# EAGLE design puck_pcb (EAGLE 7.2.0)
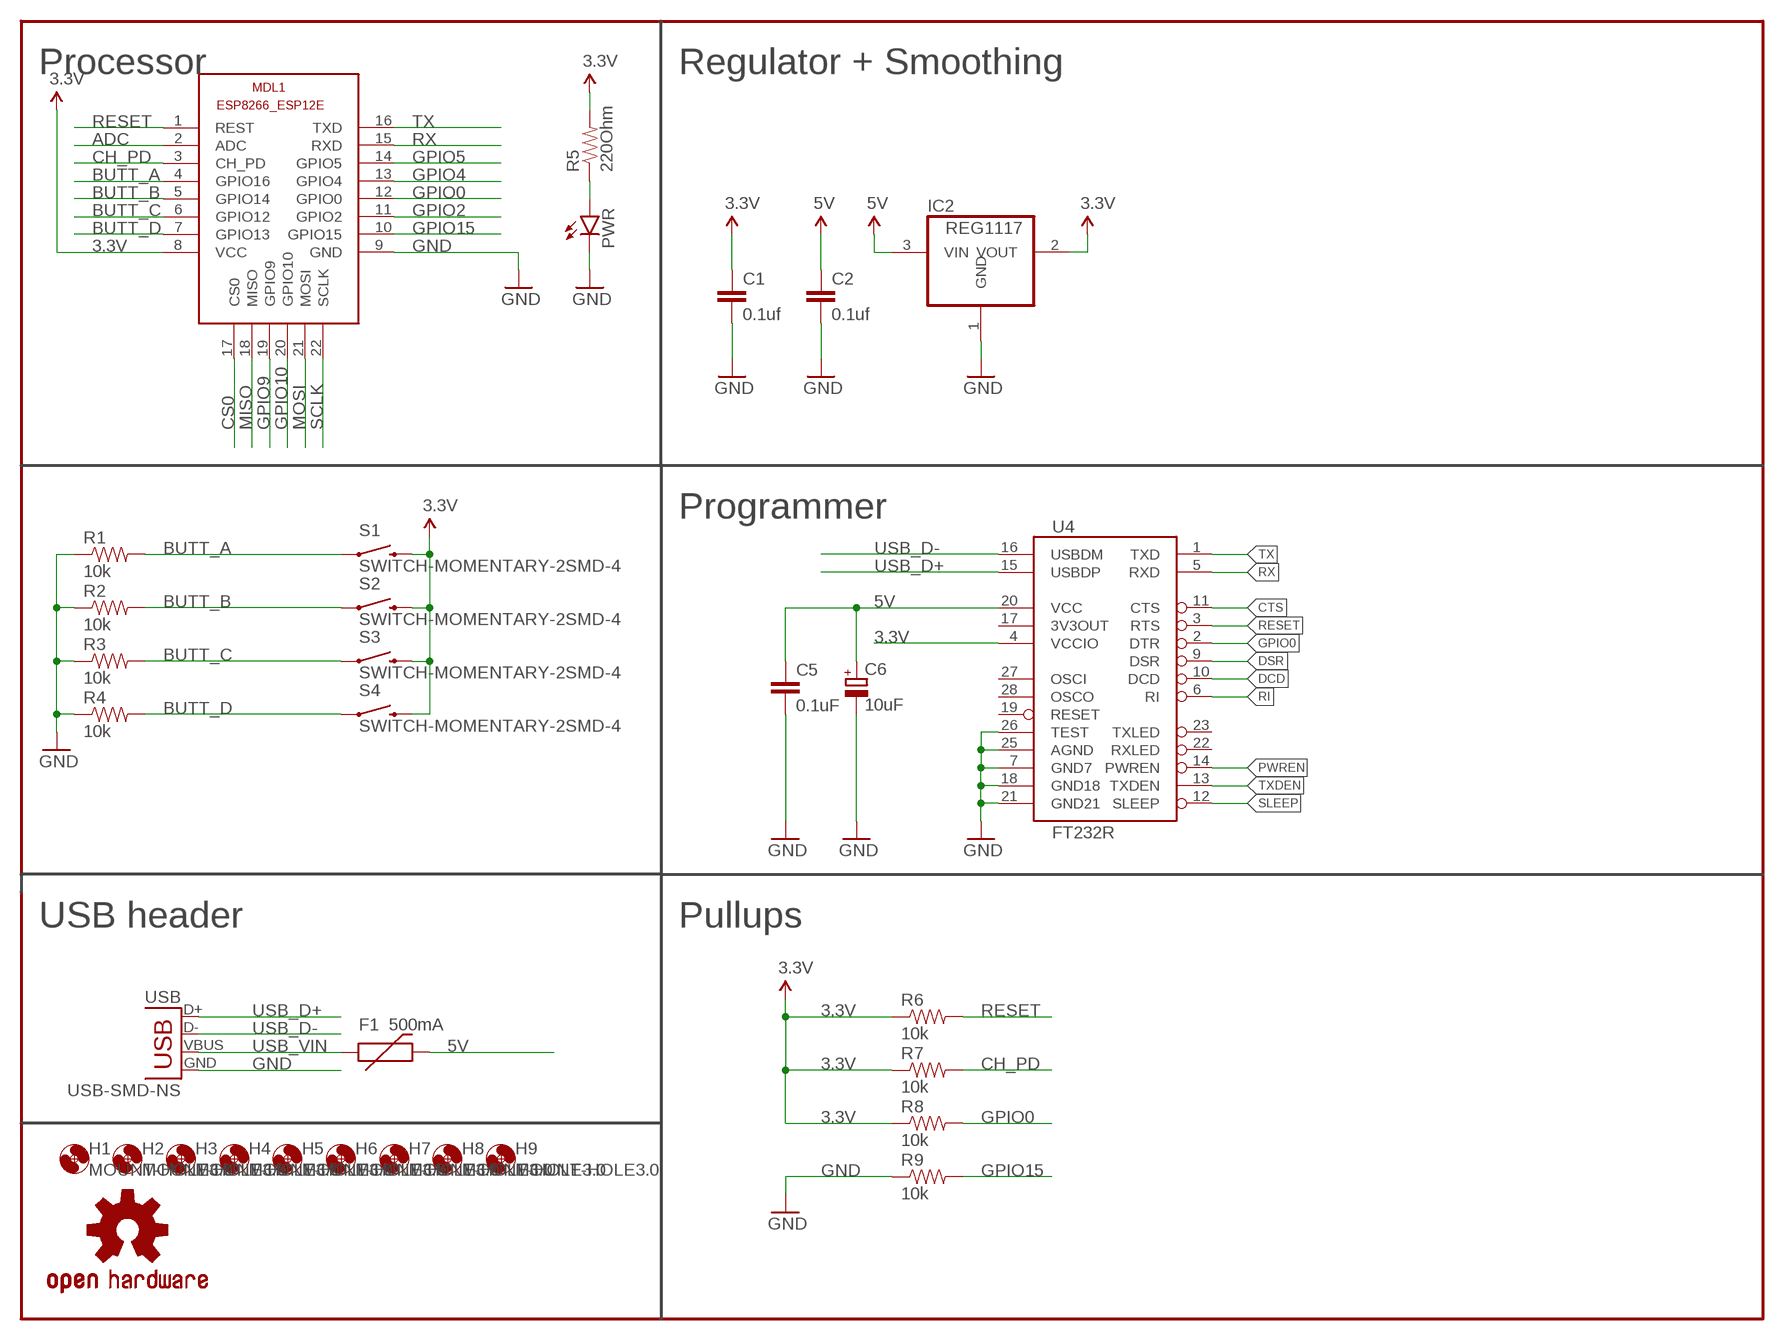
[diagram p0: schematic, sheet 1]

## Parts
C1  0.1uf  CAP1206  [1206]
C2  0.1uf  CAP1206  [1206]
C5  0.1uF  C-EUC1206K  [C1206K]
C6  10uF  CPOL-EUSMCA  [SMC_A]
F1  500mA  PTCSMD  [PTC-1206]
FRAME2  FRAME-LETTERNO_PACKAGE  [DUMMY]
H1  MOUNT-HOLE3.0  [3,0]
H2  MOUNT-HOLE3.0  [3,0]
H3  MOUNT-HOLE3.0  [3,0]
H4  MOUNT-HOLE3.0  [3,0]
H5  MOUNT-HOLE3.0  [3,0]
H6  MOUNT-HOLE3.0  [3,0]
H7  MOUNT-HOLE3.0  [3,0]
H8  MOUNT-HOLE3.0  [3,0]
H9  MOUNT-HOLE3.0  [3,0]
IC2  REG1117  [SOT223]
LOGO1  OSHW-LOGOS  [OSHW-LOGO-S]
MDL1  ESP8266-12EESP8266-ESP12E  [ESP8266-ESP12E]
PWR  LED1206  [LED-1206]
R1  10k  RESISTOR1206  [1206]
R2  10k  RESISTOR1206  [1206]
R3  10k  RESISTOR1206  [1206]
R4  10k  RESISTOR1206  [1206]
R5  220Ohm  RESISTOR1206  [1206]
R6  10k  RESISTOR1206  [1206]
R7  10k  RESISTOR1206  [1206]
R8  10k  RESISTOR1206  [1206]
R9  10k  RESISTOR1206  [1206]
S1  SWITCH-MOMENTARY-2SMD-4  [TACTILE_SWITCH_TALL]
S2  SWITCH-MOMENTARY-2SMD-4  [TACTILE_SWITCH_TALL]
S3  SWITCH-MOMENTARY-2SMD-4  [TACTILE_SWITCH_TALL]
S4  SWITCH-MOMENTARY-2SMD-4  [TACTILE_SWITCH_TALL]
U4  FT232R  FT232RLSSOP  [SSOP28DB]
USB  USB-SMD-NS  [USB-MINIB-NOSTOP]

## Nets
3.3V: C1.1 IC2.2(VOUT) MDL1.8(VCC) R5.2 R6.1 R7.1 R8.1 S1.B2 S2.B2 S3.B2 S4.B2 U4.4(VCCIO)
5V: C2.1 C5.1 C6.+ F1.2 IC2.3(VIN) U4.20(VCC)
ADC: MDL1.2(ADC)
BUTT_A: MDL1.4(GPIO16) R1.2 S1.A2
BUTT_B: MDL1.5(GPIO14) R2.2 S2.A2
BUTT_C: MDL1.6(GPIO12) R3.2 S3.A2
BUTT_D: MDL1.7(GPIO13) R4.2 S4.A2
CH_PD: MDL1.3(CH_PD) R7.2
CS0: MDL1.17(CS0)
CTS: U4.11(CTS)
DCD: U4.10(DCD)
DSR: U4.9(DSR)
GND: C1.2 C2.2 C5.2 C6.- IC2.1(GND) MDL1.9(GND) PWR.C R1.1 R2.1 R3.1 R4.1 R9.1 U4.7(GND7) U4.18(GND18) U4.21(GND21) U4.25(AGND) U4.26(TEST) USB.GND
GPIO0: MDL1.12(GPIO0) R8.2 U4.2(DTR)
GPIO2: MDL1.11(GPIO2)
GPIO4: MDL1.13(GPIO4)
GPIO5: MDL1.14(GPIO5)
GPIO9: MDL1.19(GPIO9)
GPIO10: MDL1.20(GPIO10)
GPIO15: MDL1.10(GPIO15) R9.2
MISO: MDL1.18(MISO)
MOSI: MDL1.21(MOSI)
N$1: PWR.A R5.1
PWREN: U4.14(PWREN)
RESET: MDL1.1(REST) R6.2 U4.3(RTS)
RI: U4.6(RI)
RX: MDL1.15(RXD) U4.5(RXD)
SCLK: MDL1.22(SCLK)
SLEEP: U4.12(SLEEP)
TX: MDL1.16(TXD) U4.1(TXD)
TXDEN: U4.13(TXDEN)
USB_D+: U4.15(USBDP) USB.D+
USB_D-: U4.16(USBDM) USB.D-
USB_VIN: F1.1 USB.VBUS
Unconnected: U4.17(3V3OUT) U4.19(RESET) U4.22(RXLED) U4.23(TXLED) U4.27(OSCI) U4.28(OSCO)

## Notes on the sheet
- Processor | Regulator + Smoothing
- Programmer
- USB header | Pullups

## Library data of the parts
C1 C2 = SparkFun-Capacitors:CAP: Capacitor Standard 0603 ceramic capacitor, and 0.1" leaded capacitor.
C5 = rcl:C-EU: CAPACITOR, European symbol
C6 = rcl:CPOL-EU: POLARIZED CAPACITOR, European symbol
F1 = SparkFun:PTC: Resettable Fuse PTC Resettable Fuse. Spark Fun Electronics SKU : COM-08357
FRAME2 = SparkFun-Aesthetics:FRAME-LETTER: Schematic Frame Standard 8.5x11 US Letter frame; DESIGNER: Nobody; VERSION: v01
H1-H9 = holes:MOUNT-HOLE: MOUNTING HOLE with drill center marker
IC2 = burr-brown:REG1117: 800mA and 1A Low Dropout (LDO) Positive Regulator 1.8V, 2.5V, 2.85V, 3.3V, 5V, and Adj; MPN: REG1117; OC_FARNELL: 1097566; OC_NEWARK: 14P6981
LOGO1 = SparkFun-Aesthetics:OSHW-LOGO: Open Source Hardware Logo This logo indicates the piece of hardware it is found on incorporates a OSHW license and/or adheres to the definition of open source hardware found here: http://freedomdefined.org/OSHW
MDL1 = ESP8266-ESP12E:ESP8266-12E: ESP8266-12E with additional I/O and GPIO04/05 corrected The author cannot warrant that this library is free from error or will meet your specific requirements. Created by PuceBaboon.com. Komagane, Nagano, JAPAN
PWR = SparkFun-LED:LED: LEDs Standard schematic elements and footprints for 5mm, 3mm, 1206, and 0603 sized LEDs. 5mm - Spark Fun Electronics SKU : COM-00529 (and others)
R1-R9 = SparkFun-Resistors:RESISTOR: Resistor Basic schematic elements and footprints for 0603, 1206, and PTH resistors.
S1-S4 = SparkFun-Electromechanical:SWITCH-MOMENTARY-2: Various NO switches- pushbuttons, reed, etc; PROD_ID: SWCH-11966
U4 = SparkFun:FT232RL: USB UART FT232RL 4th Generation USB UART (USB <-> Serial) Controller. Spark Fun Electronics SKU : COM-00650
USB = SparkFun-Connectors:USB: USB Connectors USB-B-PTH is fully proven SKU : PRT-00139/CONN-08278 USB-miniB is fully proven SKU : PRT-00587 USB-A-PCB is untested. USB-A-H is throughly reviewed, but untested. Spark Fun Electronics SKU : PRT-00437 USB-B-SMT is throughly reviewed, but untested. Needs silkscreen touching up. USB-A-S has not been used/tested USB-MB-H has not been used/tested USB-MICROB has been used. CONN-09505

## Board
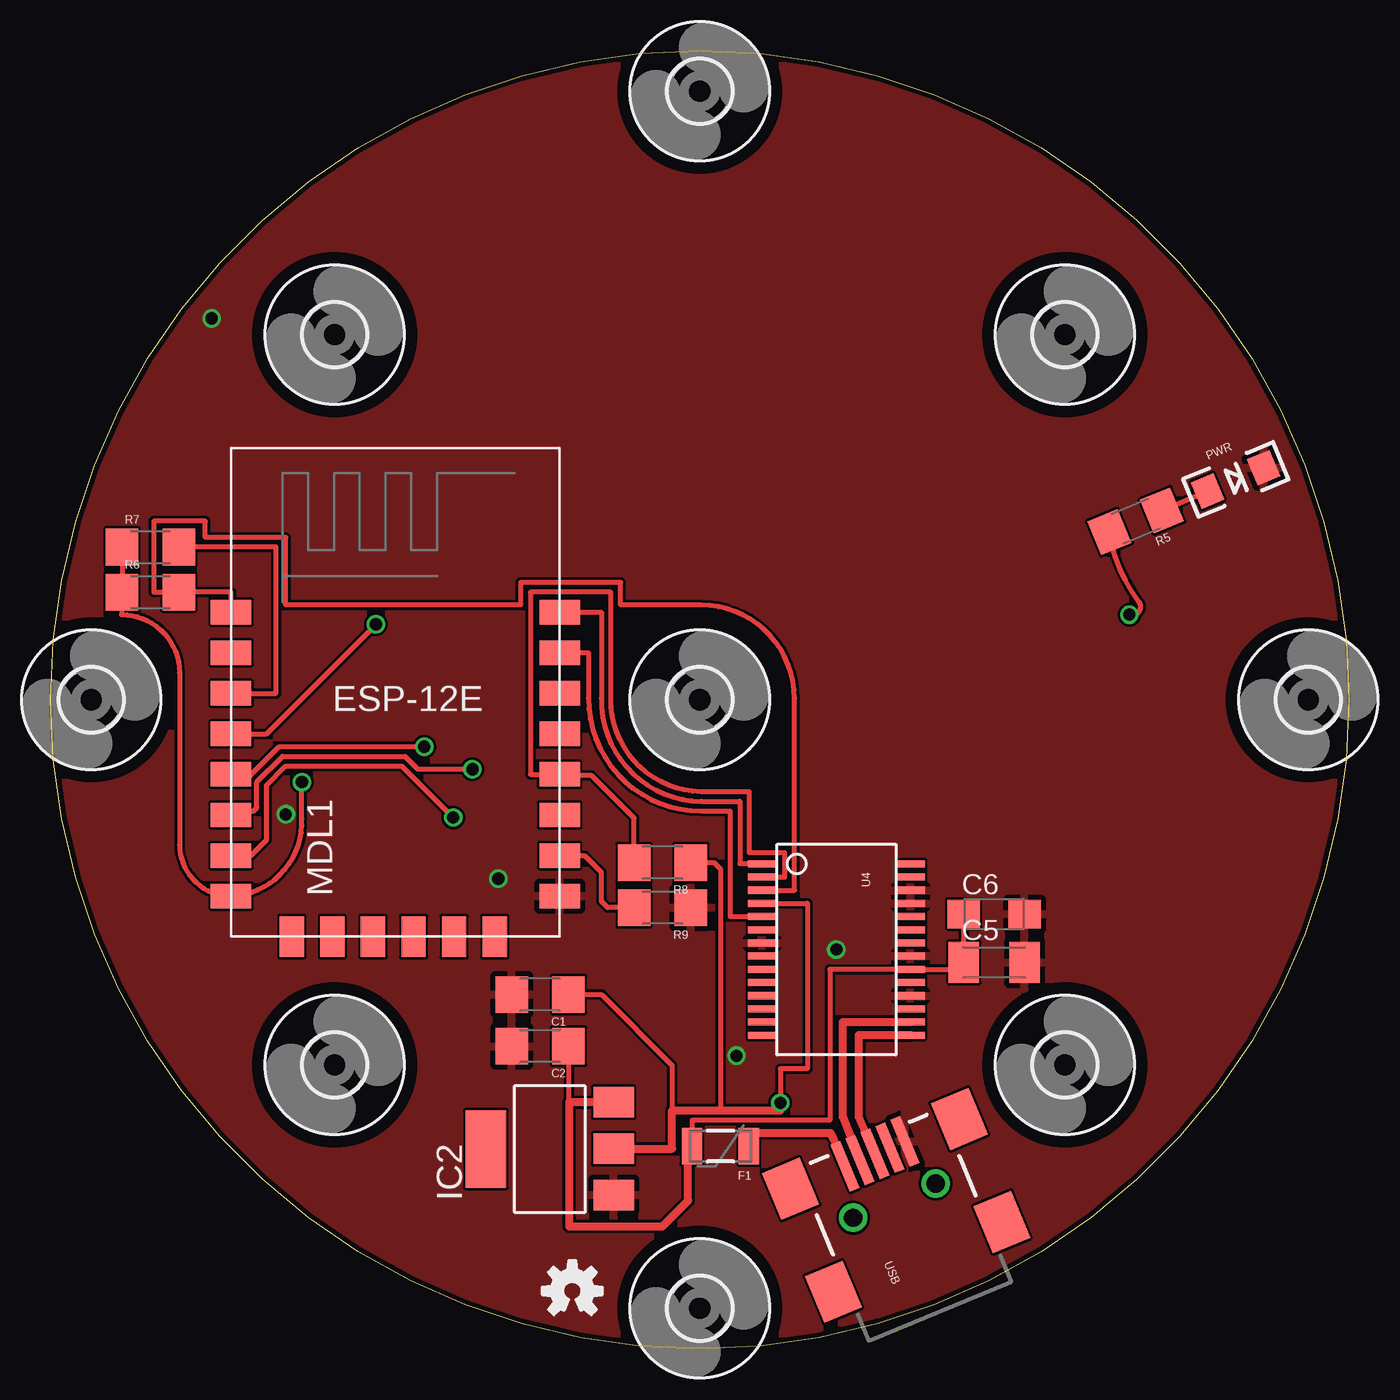
[diagram p1: board, top side]
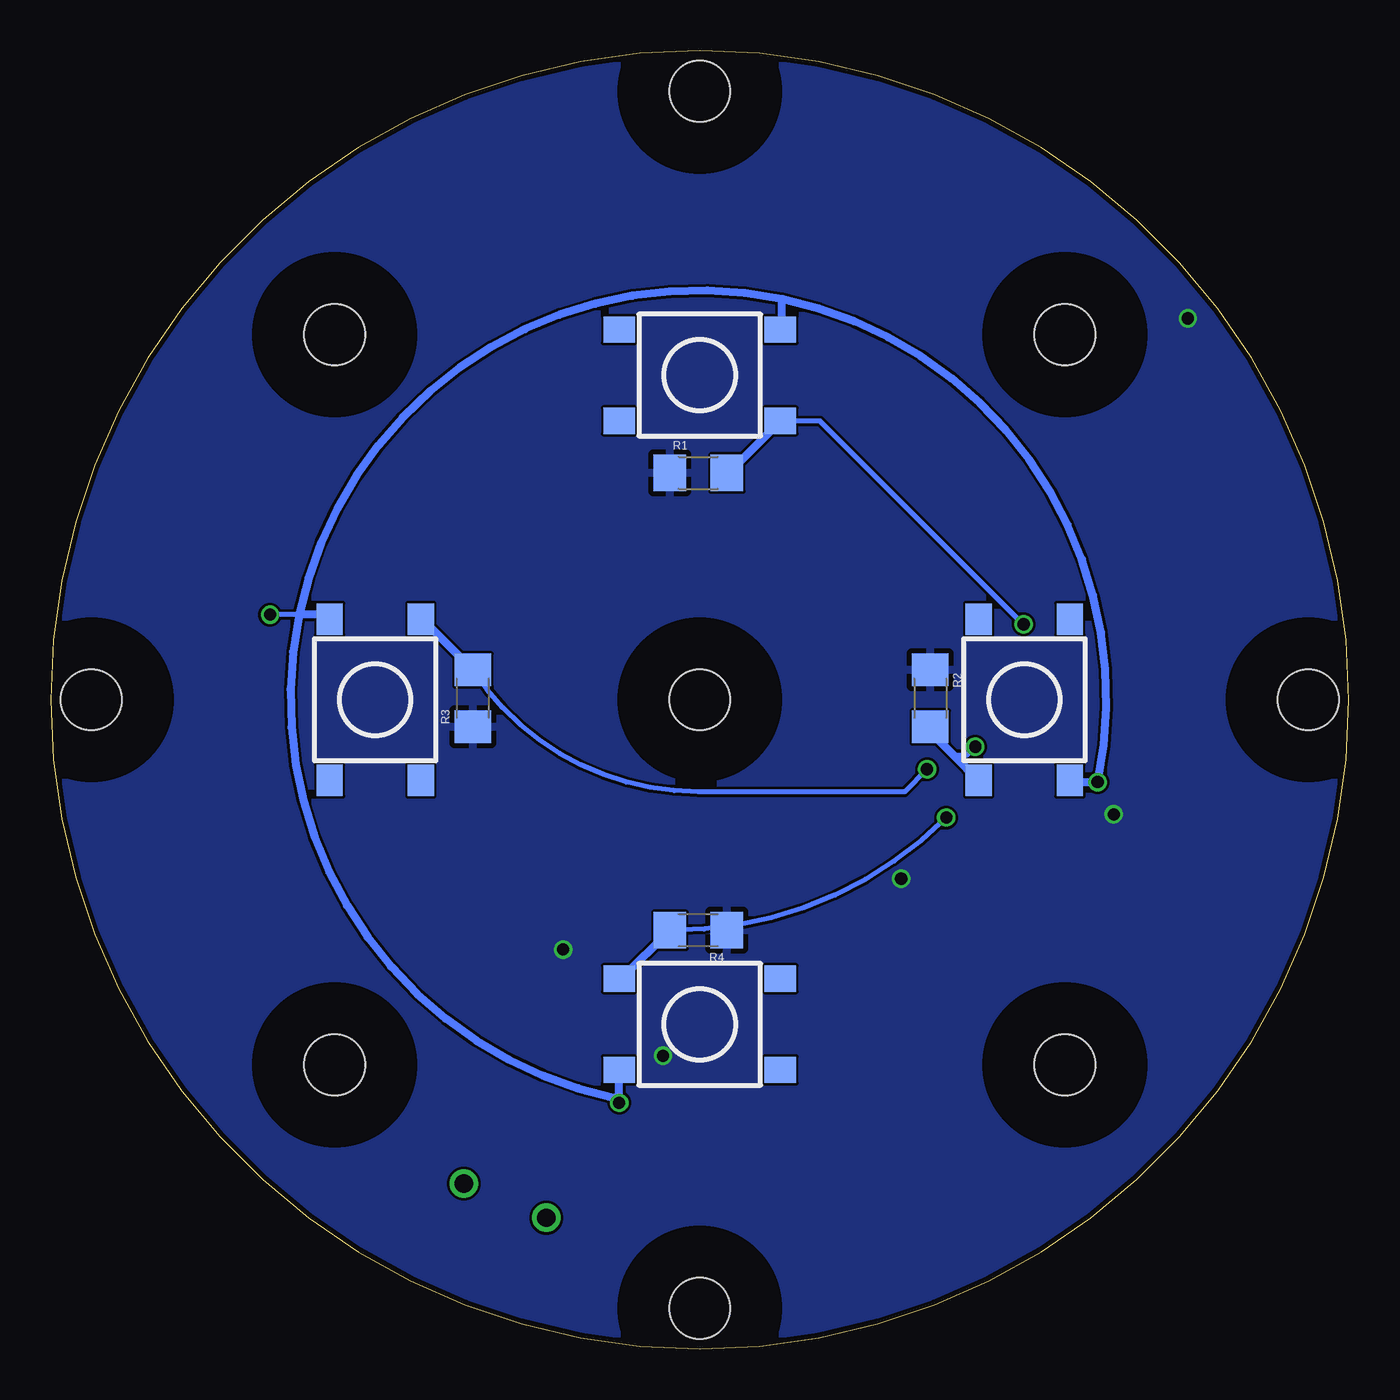
[diagram p2: board, bottom side, seen from below]

Size 64 x 64 mm. Coordinates in mm from the lower left corner, seen from the top.
Outline: 0,32 arc-90 32,64 arc-90 64,32 arc-90 32,0 arc-90 0,32
Copper layers (1*16): Top 0.035mm / dielectric 1.5mm / Bottom 0.035mm
Design rules "dirtypcbs": minimum track width 5mil, minimum drill 12mil, track to track 5mil, track to pad 5mil, pad to pad 5mil, via to via 5mil, smd to smd 0mil, copper to edge 10mil, drill to drill 10mil, minimum pad ring 10mil, minimum via ring 6mil, stop-mask expansion 2mil, vias tented up to drill 25mil, thermal gap 10mil

### Footprints (pad centres in the part's own frame; a part is rotated, then mirrored left to right if it is on the bottom)
1206 = smd 1.6 x 1.8: 1 -1.4,0; 2 1.4,0
C1206K = smd 1.5 x 2: 1 -1.5,0; 2 1.5,0
SMC_A = smd 1.6 x 1.4: + -1.5,0; - 1.5,0
PTC-1206 = smd 1 x 1.8: 1 -1.4,0; 2 1.4,0
3,0 = hole 3: 0,0
SOT223 = smd 1.499 x 2.007: 1 -2.261,-3.15; 2 0.025,-3.15; 3 2.311,-3.15 | smd 3.81 x 2.007: 4 0,3.15
ESP8266-ESP12E = smd 2 x 1.2: 1 0,16; 2 0,14; 3 0,12; 4 0,10; 5 0,8; 6 0,6; 7 0,4; 8 0,2; 9 16.2,2; 10 16.2,4; 11 16.2,6; 12 16.2,8; 13 16.2,10; 14 16.2,12; 15 16.2,14; 16 16.2,16 | smd 1.2 x 2: 17 11,0; 18 3,0; 19 5,0; 20 13,0; 21 7,0; 22 9,0
LED-1206 = smd 1.2 x 1.4: A -1.5,0; C 1.5,0
TACTILE_SWITCH_TALL = smd 1.55 x 1.3: A1 -3.975,-2.25; A2 3.975,-2.25; B1 -3.975,2.25; B2 3.975,2.25
SSOP28DB = smd 0.348 x 1.397: 1 -4.225,-3.656; 2 -3.575,-3.656; 3 -2.925,-3.656; 4 -2.275,-3.656; 5 -1.625,-3.656; 6 -0.975,-3.656; 7 -0.325,-3.656; 8 0.325,-3.656; 9 0.975,-3.656; 10 1.625,-3.656; 11 2.275,-3.656; 12 2.925,-3.656; 13 3.575,-3.656; 14 4.225,-3.656; 15 4.225,3.656; 16 3.575,3.656; 17 2.925,3.656; 18 2.275,3.656; 19 1.625,3.656; 20 0.975,3.656; 21 0.325,3.656; 22 -0.325,3.656; 23 -0.975,3.656; 24 -1.625,3.656; 25 -2.275,3.656; 26 -2.925,3.656; 27 -3.575,3.656; 28 -4.225,3.656
USB-MINIB-NOSTOP = smd 2.5 x 0.5: D+ 2.5,0; D- 2.5,0.8; GND 2.5,-1.6; ID 2.5,-0.8; VBUS 2.5,1.6 | smd 2.5 x 2: G1 -3,-4.5; G2 -3,4.5; G3 2.5,4.5; G4 2.5,-4.5 | drill 0.9 pad 0.8: H1 0,2.2 | drill 0.9 pad 0.787: H2 0,-2.2

### Placement (x,y rotation side)
C1  24.13,17.46 180 top
C2  24.13,14.92 180 top
C5  46.51,19.05 0 top
C6  46.51,21.43 0 top
F1  33.02,10 180 top
FRAME2  27.94,-65.09 0 top  (outside the outline)
H1  2,32 0 top
H2  32,62 0 top
H3  62,32 0 top
H4  32,2 0 top
H5  32,32 0 top
H6  50,14 0 top
H7  50,50 0 top
H8  14,50 0 top
H9  14,14 0 top
IC2  24.61,9.84 90 top
LOGO1  25.72,2.86 0 top
MDL1  8.89,20.32 0 top
PWR  58.42,42.86 22.5 top
R1  32.07,43.18 0 bottom
R2  20.64,32.07 270 bottom
R3  43.18,32.07 90 bottom
R4  32.07,20.64 180 bottom
R5  53.5,40.8 202.5 top
R6  4.92,37.31 0 top
R7  4.92,39.53 0 top
R8  30.16,23.97 180 top
R9  30.16,21.75 180 top
S1  32,48 0 bottom
S2  16,32 270 bottom
S3  48,32 90 bottom
S4  32,16 180 bottom
U4  38.73,19.68 270 top
USB  41.59,7.3 112.5 top

### Tracks (layer width: path | path; a pad name or v marks a point on that pad's centre or on a via)
3.3V  (via drill 0.6)
  Top 0.254: U4.4 37.31,21.96 37.31,13.81 35.98,13.81 v35.98,12.13 | R7.1 R6.1 3.49,37.31 3.49,36.2 arc-90 6.35,33.34 6.35,24.86 arc90 MDL1.8 arc90 12.38,26.13 v12.38,27.94 | v53.18,36.2 53.34,36.2 arc127 53.66,36.83 arc-28 R5.2 | R8.1 32.7,23.97 33.02,23.65 33.02,11.91 33.18,11.75 | C1.1 27.15,17.46 30.64,13.97 30.64,11.75
  Top 0.406: IC2.2 30.64,9.87 30.64,11.75 33.18,11.75 35.98,11.75 v35.98,12.13
  Bottom 0.254: 51.75,36.2 v53.18,36.2
  Bottom 0.406: S2.B2 arc-90 13.66,27.94 v12.38,27.94 arc-90 27.94,51.75 | 27.94,51.75 arc-90 51.75,36.2 | 51.75,36.2 arc-90 36.2,12.38 arc-90 v35.98,12.13 S4.B2 | S1.B2 arc-90 27.94,50.34 27.94,51.75 | S3.B2 arc-90 50.47,36.2 51.75,36.2
5V
  Top 0.254: F1.2 31.62,11.27 38.42,11.27 38.42,18.71 U4.20 45.01,18.71 C5.1 C6.+ | 25.56,12.15 25.56,14.89 C2.1
  Top 0.406: IC2.3 25.56,12.15 25.56,6.03 30.16,6.03 31.43,7.3 31.43,10.45 F1.2
BUTT_A  (via drill 0.6)
  Top 0.254: MDL1.4 10.63,30.32 v16.03,35.72
  Bottom 0.254: v16.03,35.72 26.07,45.75 S1.A2
  Bottom 0.406: S1.A2 30.59,43.18 R1.2
BUTT_B  (via drill 0.6)
  Top 0.254: MDL1.5 8.95,28.26 9.84,28.26 11.27,29.69 v18.41,29.69
  Bottom 0.254: v18.41,29.69 18.85,29.26 19.48,29.26
  Bottom 0.406: S2.A2 19.48,29.26 20.64,30.41 R2.2
BUTT_C  (via drill 0.6)
  Top 0.254: MDL1.6 9.08,26.51 10,26.51 10.16,26.67 10.16,27.94 11.43,29.21 17.46,29.21 18.1,28.57 v20.8,28.57
  Bottom 0.254: v20.8,28.57 21.91,27.46 32.07,27.46 arc57 R3.2
  Bottom 0.406: R3.2 45.69,35.98 S3.A2
BUTT_D  (via drill 0.6)
  Top 0.254: MDL1.7 9.87,24.32 10.64,25.08 10.64,27.78 11.59,28.73 17.3,28.73 v19.84,26.19
  Bottom 0.254: v19.84,26.19 arc46 R4.2
  Bottom 0.406: R4.2 35.85,18.25 S4.A2
CH_PD
  Top 0.254: MDL1.3 11.11,32.32 11.11,39.53 R7.2
GND  (via drill 0.6)
  other vias: 7.94,50.8 22.07,23.18 38.73,19.68 33.81,14.45 11.59,26.35
  pour Top: 32,64 arc-90 64,32 arc-90 32,0 arc-90 0,32 arc-90
  pour Bottom: 0,32 arc-90 32,64 arc-90 64,32 arc-90 32,0 arc-90
GPIO0
  Top 0.254: U4.2 36.2,23.26 36.2,24.45 34.45,24.45 34.45,27.46 32.07,27.46 arc-90 27.62,32.07 27.62,37.31 23.65,37.31 23.65,28.32 MDL1.12 25.15,28.26 26.67,28.26 28.76,26.16 R8.2
GPIO15
  Top 0.254: R9.2 27.46,21.75 27.15,22.07 27.15,23.5 26.35,24.29 25.12,24.29 MDL1.10
N$1
  Top 0.254: R5.1 PWR.A
RESET
  Top 0.254: MDL1.1 8.89,37.31 R6.2 5.08,37.31 5.08,40.8 7.62,40.8 7.62,40.01 11.59,40.01 11.59,36.67 23.18,36.67 23.18,37.78 28.1,37.78 28.1,36.67 32.07,36.67 arc-90 36.67,32.07 36.67,22.61 U4.3
RX
  Top 0.254: MDL1.15 26.51,34.32 26.51,32.07 arc90 32.07,26.51 33.5,26.51 33.5,21.31 U4.5
TX
  Top 0.254: MDL1.16 27.15,36.32 27.15,32.07 arc90 32.07,26.99 33.97,26.99 33.97,23.91 U4.1
USB_D+
  Top 0.406: USB.D+ 39.85,11.43 39.85,15.46 U4.15
USB_D-
  Top 0.406: USB.D- 39.05,11.43 39.05,16.11 U4.16
USB_VIN
  Top 0.406: F1.1 34.45,10 34.45,10.64 38.42,10.64 | USB.VBUS 38.61,10.33 | 38.61,10.33 38.42,10.64 | 38.42,10.64 38.45,10.64 38.61,10.33